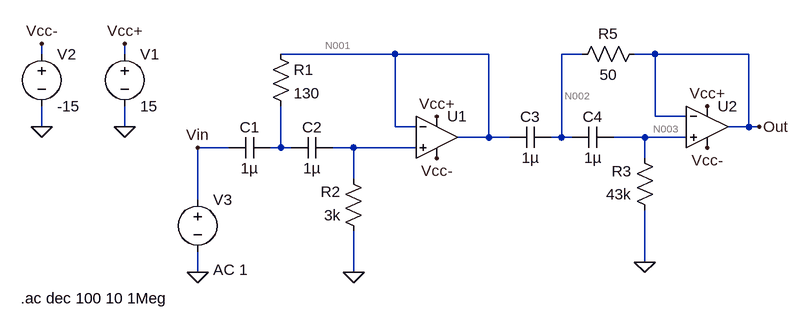
[diagram p0: schematic Filtro chebyII.asc]
Filtro chebyII.asc, the LTspice schematic file:
Version 4
SHEET 1 880 680
WIRE -400 16 -400 0
WIRE -272 16 -272 0
WIRE 144 16 -32 16
WIRE 288 16 144 16
WIRE 432 16 400 16
WIRE 544 16 512 16
WIRE 688 16 544 16
WIRE 544 112 544 16
WIRE 592 112 544 112
WIRE -400 128 -400 96
WIRE -272 128 -272 96
WIRE 144 128 144 16
WIRE 176 128 144 128
WIRE 688 128 688 16
WIRE 688 128 656 128
WIRE 704 128 688 128
WIRE 288 144 288 16
WIRE 288 144 240 144
WIRE 320 144 288 144
WIRE 400 144 400 16
WIRE 400 144 384 144
WIRE 416 144 400 144
WIRE 528 144 480 144
WIRE 592 144 528 144
WIRE -112 160 -160 160
WIRE -32 160 -32 96
WIRE -32 160 -48 160
WIRE -16 160 -32 160
WIRE 80 160 48 160
WIRE 176 160 80 160
WIRE 528 176 528 144
WIRE 80 208 80 160
WIRE -160 240 -160 160
WIRE 528 336 528 256
WIRE -160 352 -160 320
WIRE 80 352 80 288
FLAG 80 352 0
FLAG -272 128 0
FLAG -272 0 Vcc+
FLAG -400 128 0
FLAG -400 0 Vcc-
FLAG 208 176 Vcc-
FLAG 208 112 Vcc+
FLAG -160 352 0
FLAG 528 336 0
FLAG 624 96 Vcc+
FLAG 624 160 Vcc-
FLAG 704 128 Out
FLAG -160 160 Vin
SYMBOL Opamps\\UniversalOpamp2 208 144 R0
SYMATTR InstName U1
SYMBOL cap -48 144 R90
WINDOW 0 0 32 VBottom 2
WINDOW 3 32 32 VTop 2
SYMATTR InstName C1
SYMATTR Value 1µ
SYMBOL cap 48 144 R90
WINDOW 0 0 32 VBottom 2
WINDOW 3 32 32 VTop 2
SYMATTR InstName C2
SYMATTR Value 1µ
SYMBOL res 96 304 R180
WINDOW 0 36 76 Left 2
WINDOW 3 36 40 Left 2
SYMATTR InstName R2
SYMATTR Value 3k
SYMBOL voltage -272 0 R0
WINDOW 123 0 0 Left 0
WINDOW 39 0 0 Left 0
SYMATTR InstName V1
SYMATTR Value 15
SYMBOL voltage -400 0 R0
WINDOW 123 0 0 Left 0
WINDOW 39 0 0 Left 0
SYMATTR InstName V2
SYMATTR Value -15
SYMBOL voltage -160 224 R0
WINDOW 123 24 124 Left 2
WINDOW 39 0 0 Left 0
SYMATTR Value2 AC 1
SYMATTR InstName V3
SYMATTR Value ""
SYMBOL Opamps\\UniversalOpamp2 624 128 R0
SYMATTR InstName U2
SYMBOL res 528 0 R90
WINDOW 0 0 56 VBottom 2
WINDOW 3 32 56 VTop 2
SYMATTR InstName R5
SYMATTR Value 50
SYMBOL cap 384 128 R90
WINDOW 0 0 32 VBottom 2
WINDOW 3 32 32 VTop 2
SYMATTR InstName C3
SYMATTR Value 1µ
SYMBOL cap 480 128 R90
WINDOW 0 0 32 VBottom 2
WINDOW 3 32 32 VTop 2
SYMATTR InstName C4
SYMATTR Value 1µ
SYMBOL res 544 272 R180
WINDOW 0 36 76 Left 2
WINDOW 3 36 40 Left 2
SYMATTR InstName R3
SYMATTR Value 43k
SYMBOL res -48 0 R0
SYMATTR InstName R1
SYMATTR Value 130
TEXT -432 392 Left 2 !.ac dec 100 10 1Meg

The netlist it stands for:
* Filtro chebyII.asc
XU1 N005 N001 Vcc+ Vcc- N001 level.2 Avol=1Meg GBW=10Meg Slew=10Meg ilimit=25m rail=0 Vos=0 phimargin=45 en=0 enk=0 in=0 ink=0 Rin=500Meg  ; pins IN+ IN- V+ V- OUT
C1 N004 Vin 1µ
C2 N005 N004 1µ
R2 0 N005 3k
V1 Vcc+ 0 15
V2 Vcc- 0 -15
V3 Vin 0 AC 1
XU2 N003 Out Vcc+ Vcc- Out level.2 Avol=1Meg GBW=10Meg Slew=10Meg ilimit=25m rail=0 Vos=0 phimargin=45 en=0 enk=0 in=0 ink=0 Rin=500Meg  ; pins IN+ IN- V+ V- OUT
R5 Out N002 50
C3 N002 N001 1µ
C4 N003 N002 1µ
R3 0 N003 43k
R1 N001 N004 130
.ac dec 100 10 1Meg
.lib UniversalOpamps2.sub
.backanno
.end

* Results of the author's LTspice run, read from the files saved beside the schematic
* Operating Point, zero values left out:
*   V(vcc+) = 15 V
*   V(vcc-) = -15 V
*   I(V2) = 2.997 mA
*   I(V1) = -2.997 mA
*   Ix(u1:3) = 1.498 mA
*   Ix(u1:4) = -1.498 mA
*   Ix(u2:3) = 1.498 mA
*   Ix(u2:4) = -1.498 mA
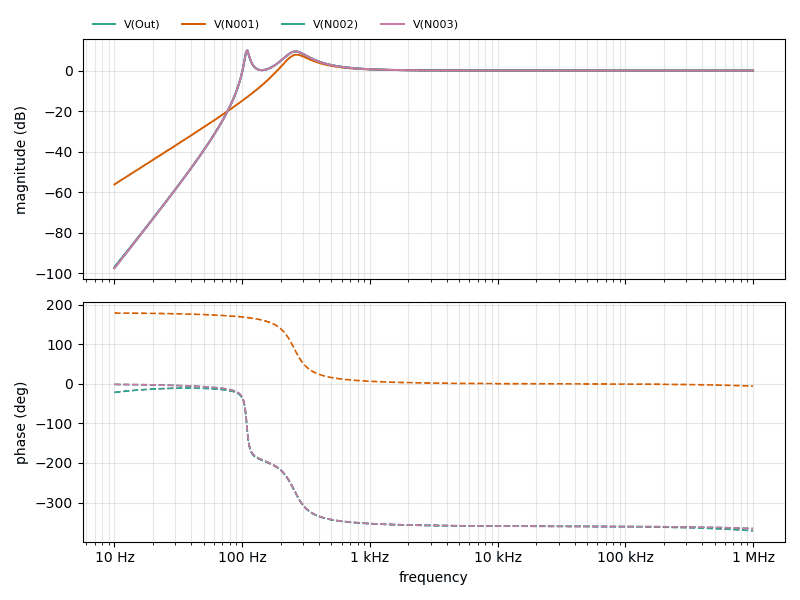
[diagram p1: AC Analysis of Filtro chebyII.asc, plotted from the saved traces]
* AC Analysis, 1 run:
*   V(Out): -97.59 dB at 10 Hz, -0.10 dB at 1 MHz, peak 9.95 dB at 109.6 Hz, 3 dB below the peak at 105.6 Hz and 113.6 Hz
*   V(N001): -56.24 dB at 10 Hz, -0.04 dB at 1 MHz, peak 7.80 dB at 269.2 Hz, 3 dB below the peak at 221.7 Hz and 358.5 Hz
*   V(N002): -97.03 dB at 10 Hz, -0.04 dB at 1 MHz, peak 9.96 dB at 109.6 Hz, 3 dB below the peak at 105.6 Hz and 113.6 Hz
*   V(N003): -97.59 dB at 10 Hz, -0.04 dB at 1 MHz, peak 9.95 dB at 109.6 Hz, 3 dB below the peak at 105.6 Hz and 113.6 Hz